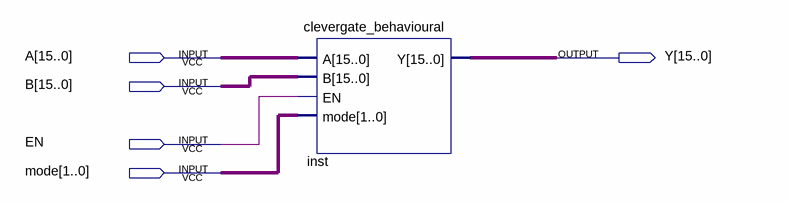
[diagram p0: schematic sheet]
// Quartus schematic behavioural.bdf as structural Verilog: 1 symbols, 5 pins
module behavioural (
  input  [15:0] A,
  input  [15:0] B,
  input  EN,
  input  [1:0] mode,
  output [15:0] Y
);

  clevergate_behavioural inst (.A(A), .B(B), .EN(EN), .mode(mode), .Y(Y));
endmodule
